# EAGLE design Circulator_Board (EAGLE 9.6.2)
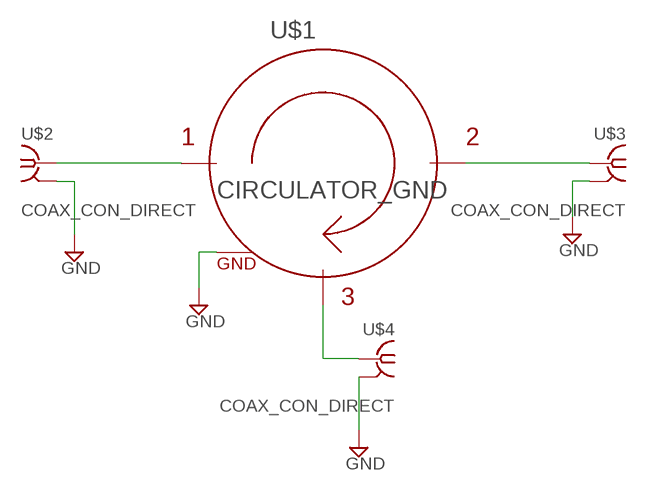
[diagram p0: schematic, sheet 1]

## Parts
U$1  CIRCULATOR_GND  [JCD0126T0130LC100]
U$2  COAX_CON_DIRECT  [COAX.141]
U$3  COAX_CON_DIRECT  [COAX.141]
U$4  COAX_CON_DIRECT  [COAX.141]

## Nets
GND: U$1.P$1(P$GND) U$1.P$2(P$GND) U$1.P$3(P$GND) U$1.P$4(P$GND) U$2.P$2(GND) U$3.P$2(GND) U$4.P$2(GND)
N$1: U$1.P$IN U$2.P$1
N$2: U$1.P$OUT U$3.P$1
N$3: U$1.P$LOAD U$4.P$1

## Library data of the parts
U$1 = Orzada:CIRCULATOR_GND: Circulators (Drop-In)
U$2-U$4 = Orzada:COAX_CON_DIRECT: Direct Coax to Bord Top

## Board
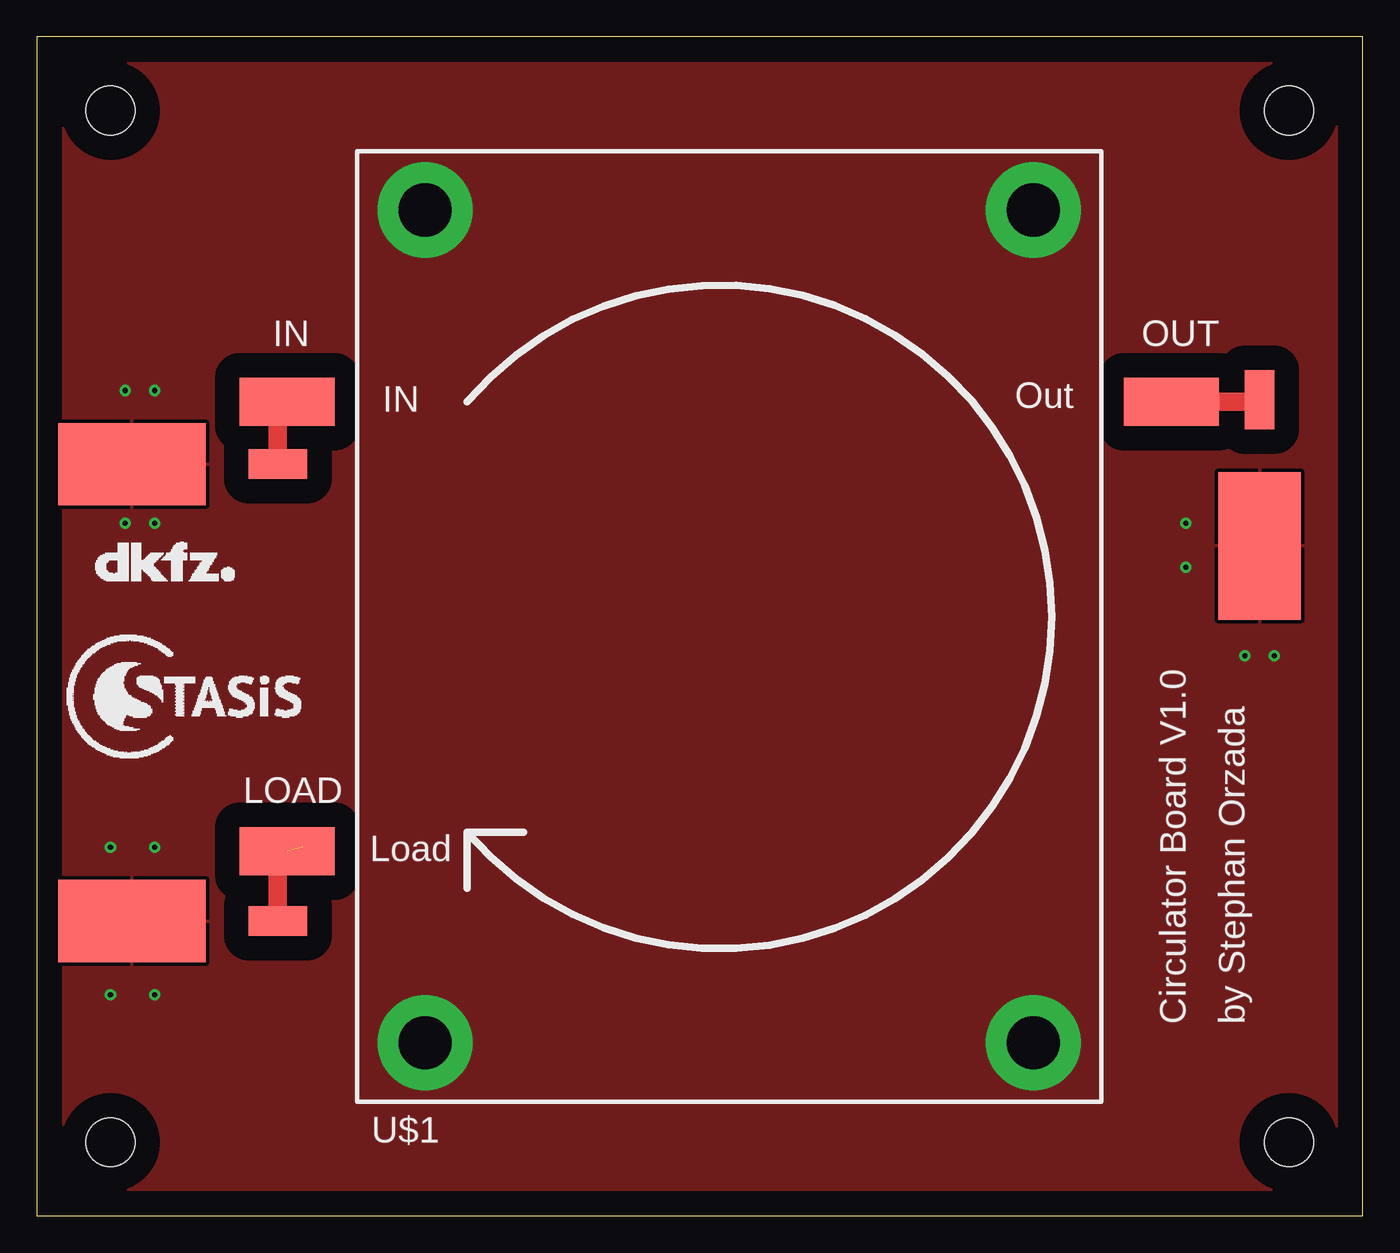
[diagram p1: board, top side]
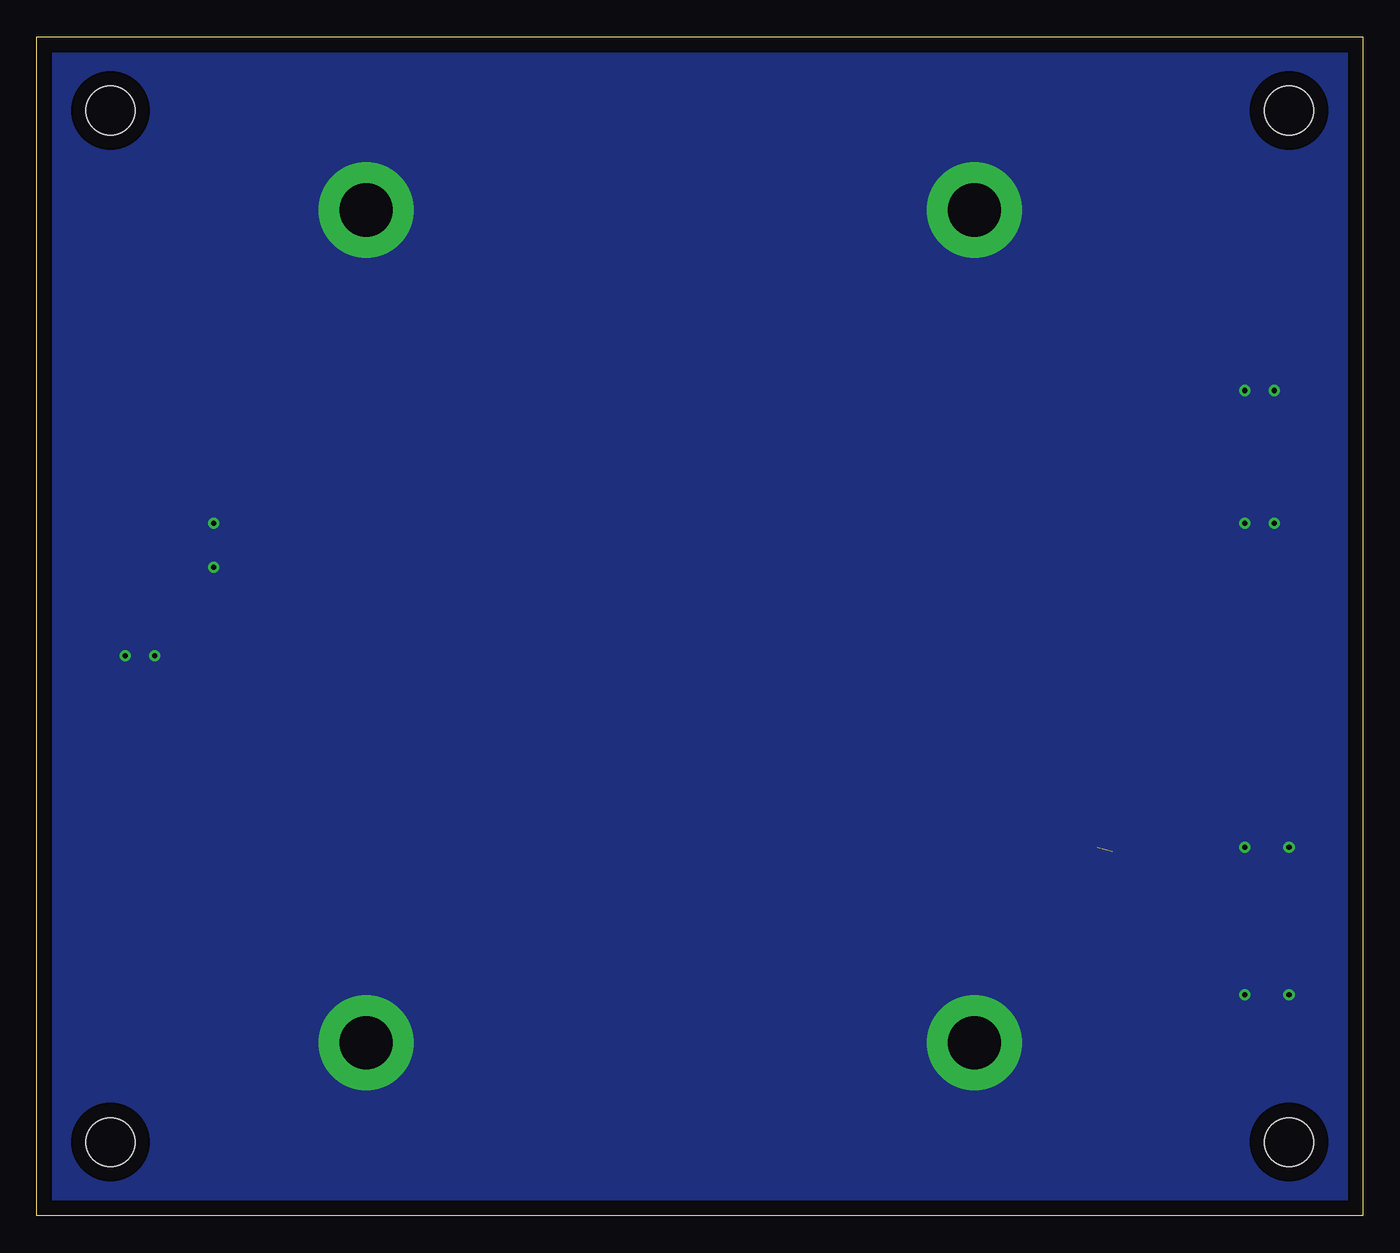
[diagram p2: board, bottom side, seen from below]

Size 90 x 80 mm. Coordinates in mm from the lower left corner, seen from the top.
Outline: 0,0 90,0 90,80 0,80 0,0
Copper layers (1*16): Top 0.035mm / dielectric 1.5mm / Bottom 0.035mm
Design rules "default": minimum track width 6mil, minimum drill 0.35mm, track to track 6mil, track to pad 6mil, pad to pad 6mil, via to via 6mil, smd to smd 6mil, copper to edge 40mil, drill to drill 6mil, minimum pad ring 10mil, minimum via ring 8mil, stop-mask expansion 4mil, vias tented up to drill 0mil, thermal gap 10mil
Holes 3.3 mm at 5,5 85,5 85,75 5,75

### Footprints (pad centres in the part's own frame; a part is rotated, then mirrored left to right if it is on the bottom)
JCD0126T0130LC100 = drill 3.6 pad 6.452: P$1 20.65,28.25; P$2 -20.65,28.25; P$3 20.65,-28.25; P$4 -20.65,-28.25 | smd 6.452 x 3.251: P$IN -30,15.25; P$LOAD -30,-15.25; P$OUT 30,15.25
COAX.141 = smd 4 x 2: P$1 -3.364,0 | smd 10 x 5.588: P$2 6.546,0

### Placement (x,y rotation side)
U$1  47,40 0 top
U$2  13,51 180 top
U$3  83,52 270 top
U$4  13,20 180 top
U$5  [LOGO_DKFZ]  4,43 0 top
U$6  [LOGO_STASIS]  11,35 0 top

### Tracks (layer width: path | path; a pad name or v marks a point on that pad's centre or on a via)
GND  (via drill 0.35)
  other vias: 6,56 6,47 8,56 8,47 5,25 8,25 5,15 8,15 82,38 84,38 78,44 78,47
  pour Top (isolate 1.676): 1,79 1,1 89,1 89,79
  pour Bottom: 1,79 1,1 89,1 89,79
N$1
  Top 1.27: U$2.P$1 16.36,54.61 U$1.P$IN
N$2
  Top 1.27: U$1.P$OUT 82.89,55.25 U$3.P$1
N$3  (1 unrouted)
  Top 1.27: U$4.P$1 16.36,23.36 18,25

### Text on the board
tPlace: IN | OUT | LOAD | Circulator Board V1.0 | by Stephan Orzada